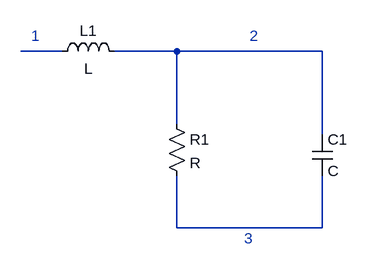
[diagram p0: schematic MyFilter_Drawing.asc]
MyFilter_Drawing.asc, the LTspice schematic file:
Version 4
SHEET 1 880 680
WIRE -96 192 -160 192
WIRE 80 192 -16 192
WIRE 304 192 80 192
WIRE 80 304 80 192
WIRE 304 320 304 192
WIRE 80 464 80 384
WIRE 304 464 304 384
WIRE 304 464 80 464
SYMBOL Ind -112 208 R270
WINDOW 0 32 56 VTop 2
WINDOW 3 5 56 VBottom 2
SYMATTR InstName L1
SYMBOL Res 64 288 R0
SYMATTR InstName R1
SYMBOL Cap 288 320 R0
SYMATTR InstName C1
TEXT -144 168 Left 2 ;1
TEXT 192 168 Left 2 ;2
TEXT 184 480 Left 2 ;3

The netlist it stands for:
* MyFilter_Drawing.asc
L1 N001 N002 L
R1 N002 N003 R
C1 N002 N003 C
* 1
* 2
* 3
.backanno
.end